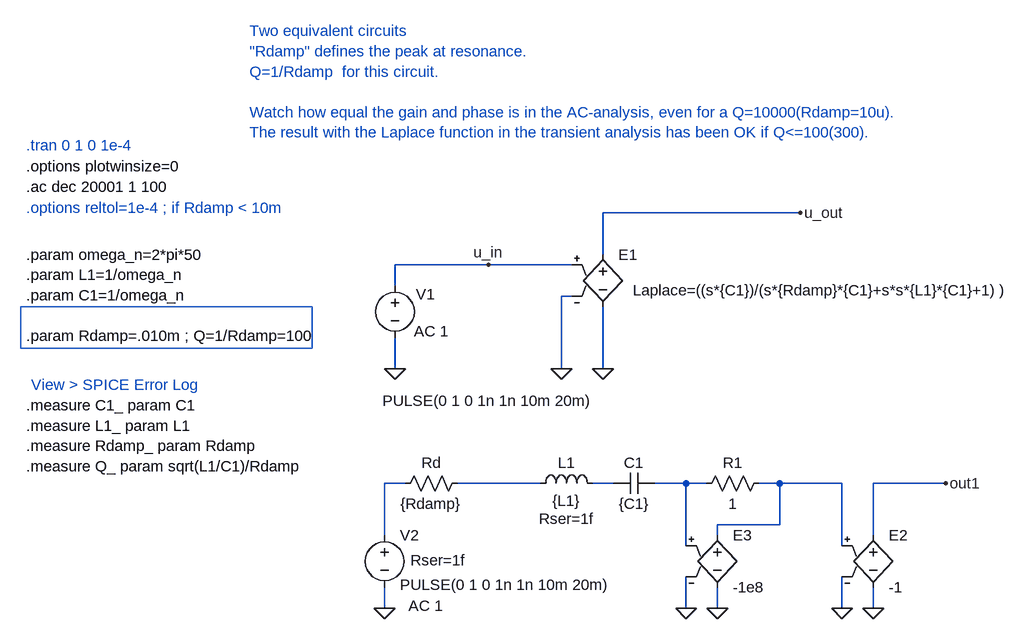
[diagram p0: schematic bandpass_laplace2.asc]
bandpass_laplace2.asc, the LTspice schematic file:
Version 4
SHEET 1 1448 724
WIRE 464 96 160 96
WIRE 160 160 160 96
WIRE -16 176 -160 176
WIRE 112 176 -16 176
WIRE -160 208 -160 176
WIRE 112 224 96 224
WIRE -160 336 -160 288
WIRE 96 336 96 224
WIRE 160 336 160 240
WIRE -144 512 -176 512
WIRE 64 512 -64 512
WIRE 176 512 144 512
WIRE 288 512 240 512
WIRE 320 512 288 512
WIRE 432 512 400 512
WIRE 528 512 432 512
WIRE 688 512 576 512
WIRE 432 576 432 512
WIRE 432 576 336 576
WIRE -176 592 -176 512
WIRE 336 592 336 576
WIRE 576 592 576 512
WIRE 288 608 288 512
WIRE 528 608 528 512
WIRE -176 704 -176 672
WIRE 288 704 288 656
WIRE 336 704 336 672
WIRE 528 704 528 656
WIRE 576 704 576 672
FLAG 160 336 0
FLAG 96 336 0
FLAG -160 336 0
FLAG -16 176 u_in
FLAG 464 96 u_out
FLAG -176 704 0
FLAG 288 704 0
FLAG 336 704 0
FLAG 528 704 0
FLAG 576 704 0
FLAG 688 512 out1
SYMBOL e 160 144 R0
WINDOW 3 46 71 Left 0
SYMATTR Value Laplace=((s*{C1})/(s*{Rdamp}*{C1}+s*s*{L1}*{C1}+1) )
SYMATTR InstName E1
SYMBOL voltage -160 192 R0
WINDOW 3 -19 193 Left 0
WINDOW 123 29 86 Left 0
WINDOW 39 0 0 Left 0
WINDOW 0 32 29 Left 0
SYMATTR Value PULSE(0 1 0 1n 1n 10m 20m)
SYMATTR Value2 AC 1
SYMATTR InstName V1
SYMBOL ind 48 528 R270
WINDOW 0 32 56 VTop 0
WINDOW 3 5 56 VBottom 0
WINDOW 39 -23 56 VBottom 0
SYMATTR InstName L1
SYMATTR Value {L1}
SYMATTR SpiceLine Rser=1f
SYMBOL cap 176 528 R270
WINDOW 0 32 32 VTop 0
WINDOW 3 0 32 VBottom 0
SYMATTR InstName C1
SYMATTR Value {C1}
SYMBOL voltage -176 576 R0
WINDOW 3 24 92 Left 0
WINDOW 123 37 124 Left 0
WINDOW 39 40 54 Left 0
SYMATTR Value PULSE(0 1 0 1n 1n 10m 20m)
SYMATTR Value2 AC 1
SYMATTR SpiceLine Rser=1f
SYMATTR InstName V2
SYMBOL e 336 576 R0
SYMATTR InstName E3
SYMATTR Value -1e8
SYMBOL res 304 528 R270
WINDOW 0 32 56 VTop 0
WINDOW 3 0 56 VBottom 0
SYMATTR InstName R1
SYMATTR Value 1
SYMBOL res -160 528 R270
WINDOW 0 32 56 VTop 0
WINDOW 3 0 56 VBottom 0
SYMATTR InstName Rd
SYMATTR Value {Rdamp}
SYMBOL e 576 576 R0
SYMATTR InstName E2
SYMATTR Value -1
TEXT -728 160 Left 0 !.param omega_n=2*pi*50\n.param L1=1/omega_n\n.param C1=1/omega_n\n \n.param Rdamp=.010m ; Q=1/Rdamp=100
TEXT -728 -8 Left 0 ;.tran 0 1 0 1e-4
TEXT -728 56 Left 0 !.ac dec 20001 1 100
TEXT -384 -184 Left 0 ;Two equivalent circuits\n"Rdamp" defines the peak at resonance.\nQ=1/Rdamp  for this circuit.\n \nWatch how equal the gain and phase is in the AC-analysis, even for a Q=10000(Rdamp=10u).\nThe result with the Laplace function in the transient analysis has been OK if Q<=100(300).
TEXT -728 24 Left 0 !.options plotwinsize=0
TEXT -728 88 Left 0 ;.options reltol=1e-4 ; if Rdamp < 10m
TEXT -728 392 Left 0 !.measure C1_ param C1\n.measure L1_ param L1\n.measure Rdamp_ param Rdamp\n.measure Q_ param sqrt(L1/C1)/Rdamp
TEXT -720 360 Left 0 ;View > SPICE Error Log
RECTANGLE Normal -736 304 -288 240

The netlist it stands for:
* bandpass_laplace2.asc
E1 u_out 0 u_in 0 Laplace=((s*{C1})/(s*{Rdamp}*{C1}+s*s*{L1}*{C1}+1) )
V1 u_in 0 PULSE(0 1 0 1n 1n 10m 20m) AC 1
L1 N002 N003 {L1} Rser=1f
C1 N003 N004 {C1}
V2 N001 0 PULSE(0 1 0 1n 1n 10m 20m) AC 1 Rser=1f
E3 N005 0 N004 0 -1e8
R1 N004 N005 1
Rd N001 N002 {Rdamp}
E2 out1 0 N005 0 -1
.param omega_n=2*pi*50
.param L1=1/omega_n
.param C1=1/omega_n
.param Rdamp=.010m ; Q=1/Rdamp=100
* .tran 0 1 0 1e-4
.ac dec 20001 1 100
* Two equivalent circuits
* "Rdamp" defines the peak at resonance.
* Q=1/Rdamp  for this circuit.
* Watch how equal the gain and phase is in the AC-analysis, even for a Q=10000(Rdamp=10u).
* The result with the Laplace function in the transient analysis has been OK if Q<=100(300).
.options plotwinsize=0
* .options reltol=1e-4 ; if Rdamp < 10m
.measure C1_ param C1
.measure L1_ param L1
.measure Rdamp_ param Rdamp
.measure Q_ param sqrt(L1/C1)/Rdamp
* View > SPICE Error Log
.backanno
.end